# Altium schematic sheet Motor_Header.SchDoc
size A4; SheetNumber: 8; SheetTotal: 11
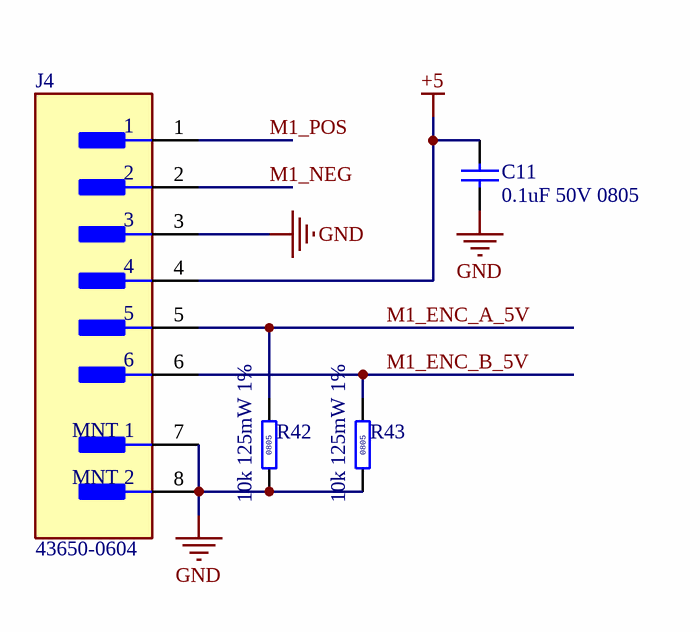
[diagram p0: Motor_Header.SchDoc]

## Parts
C11  0.1uF 50V 0805  [CAPC2012X14N]
J4  43650-0604  [FP-43650-0604-MFG]
R42  10k 125mW 1%  [RESC2013X60X35ML10T20]
R43  10k 125mW 1%  [RESC2013X60X35ML10T20]

## Nets
+5: C11.2 J4.4
GND: C11.1 J4.3 J4.7(MNT_1) J4.8(MNT_2) R42.1 R43.1
M1_ENC_A_5V: J4.5 R42.2
M1_ENC_B_5V: J4.6 R43.2
M1_NEG: J4.2
M1_POS: J4.1

## Library data of the parts
C11 = CMP-40-005-00117-1: Cap, SMD, 0.1uF, 50V, 10%, 0805, X7R; Manufacturer: Samsung; ManufacturerPartNumber: CL21B104KBCWPNC; CapacitorType: Ceramic; Value: 100nF; ComponentLinkDescription: Datasheet; Package: 0805; MountingType: SMD; VoltageRating: 50V; Tolerance: 10%; ComponentLinkURL: https://octopart.com/part/samsung-electro-mechanics/CL21B104KBCWPNC; DielectricType: Ceramic
J4 = CMP-00257-00298091-1: 43650-0604 Conn Power HDR 6 POS 3mm Solder RA Thru-Hole 6 Terminal 1 Port Micro-Fit 3.0™ Frame; Manufacturer Lifecycle Status: ACTIVE; NexarPartId: 298091; Gender: Male; Number of Contacts: 6; Current Rating: 5A; Plating: Tin; Glow Wire Compliant: Compliant; Voltage Rating: 600V; Connector Type: Male Pin; Contact Material: Brass; Color: Black; Housing Material: Plastic; Contact Gender: Male; Halogen Free: Low Halogen; Min Operating Temperature: -40°C; Pitch: 3mm; Housing Color: Black; Lifecycle Status: Production; Termination: Solder; Width: 9.9mm; Orientation: Right Angle; Length: 21.6mm; Lead Free: Contains Lead; Number of Pins: 6; Max Operating Temperature: 105°C; Number of Positions: 6; Number of Rows: 1; RoHS: Compliant; Number of Circuits: 6; Country of Origin: US; Mount: Through Hole; Contact Plating: Gold; Schedule B: 8536694040; Fastening Type: Ramp; Height: 4.37mm
R42 R43 = CMP-40-025-00226-1: Res, SMD, 10k, 125mW, 1%, ±200ppm, 0805; Manufacturer: Panasonic; ManufacturerPartNumber: ERJ-6GEYJ103V; Package Height: 0.6mm; ComponentLinkDescription: Datasheet; Voltage Rating: 150V; Tolerance: 5%; RoHS3Certificate: https://download.siliconexpert.com/pdfs2/2024/6/2/9/59/48/925943/pns_/manual/erj6enf2700v_rohs.pdf; Composition: Thick Film; Contact Plating: Tin; Reach SVHC Compliant: Unaffected; ComponentLinkURL: https://octopart.com/erj-6geyj103v-panasonic-55422885; Temperature Coefficient (ppm/cel): ±200ppm; Resistance: 10k; Max Operating Temperature: 155°C; Mount: SMD; Number of Pins: 2; Case/Package: 0805; RoHS3Compliant: Yes (with exeption); Power Rating: 125mW; Resistor Type: Fixed; Min Operating Temperature: -55°C